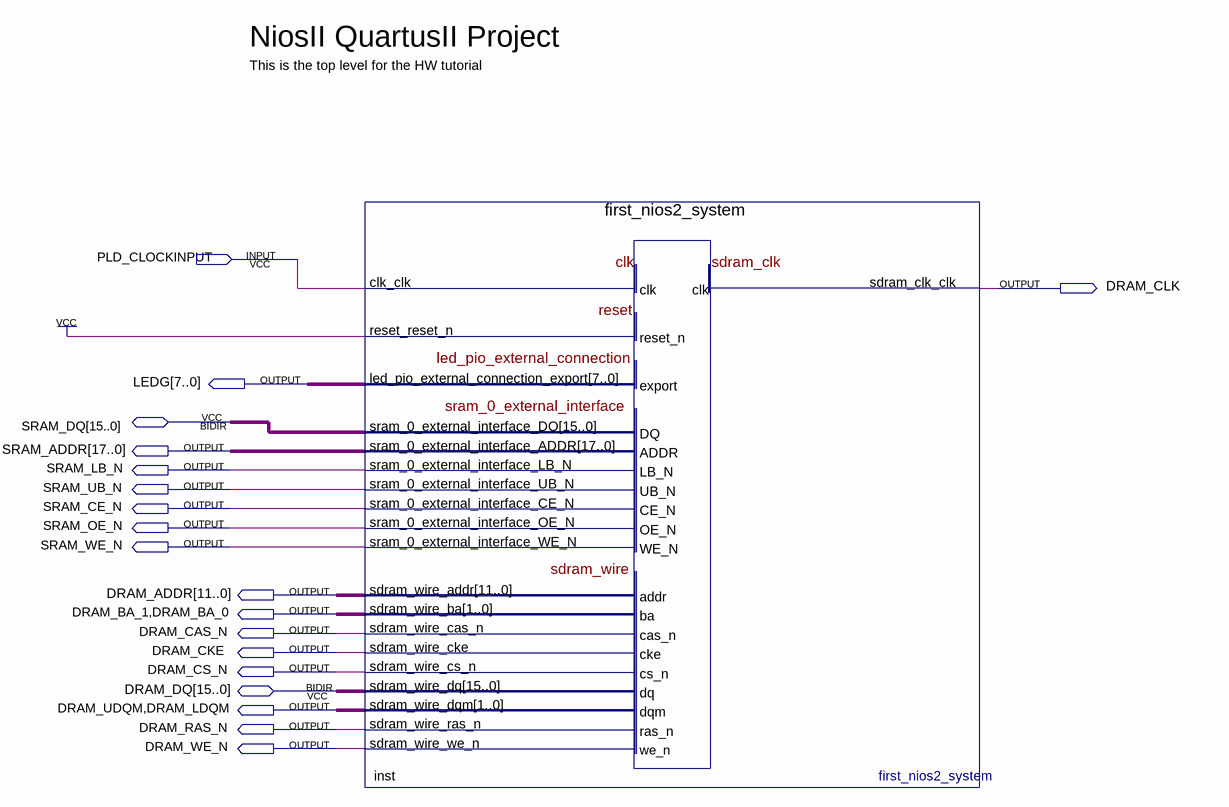
[diagram p0: schematic sheet]
// Quartus schematic nios2_quartus2_project.bdf as structural Verilog: 1 symbols, 19 pins
module nios2_quartus2_project (
  input  PLD_CLOCKINPUT,
  inout  [15:0] SRAM_DQ,
  inout  [15:0] DRAM_DQ,
  output DRAM_CLK,
  output [7:0] LEDG,
  output [17:0] SRAM_ADDR,
  output SRAM_LB_N,
  output SRAM_UB_N,
  output SRAM_CE_N,
  output SRAM_OE_N,
  output SRAM_WE_N,
  output [11:0] DRAM_ADDR,
  output DRAM_BA_1,
  output DRAM_BA_0,
  output DRAM_CAS_N,
  output DRAM_CKE,
  output DRAM_CS_N,
  output DRAM_UDQM,
  output DRAM_LDQM,
  output DRAM_RAS_N,
  output DRAM_WE_N
);

  first_nios2_system inst (
    .clk_clk(PLD_CLOCKINPUT), .reset_reset_n(1'b1), .led_pio_external_connection_export(LEDG),
    .sram_0_external_interface_ADDR(SRAM_ADDR), .sram_0_external_interface_LB_N(SRAM_LB_N),
    .sram_0_external_interface_UB_N(SRAM_UB_N), .sram_0_external_interface_CE_N(SRAM_CE_N),
    .sram_0_external_interface_OE_N(SRAM_OE_N), .sram_0_external_interface_WE_N(SRAM_WE_N),
    .sdram_wire_addr(DRAM_ADDR), .sdram_wire_ba({DRAM_BA_1, DRAM_BA_0}), .sdram_wire_cas_n(DRAM_CAS_N),
    .sdram_wire_cke(DRAM_CKE), .sdram_wire_cs_n(DRAM_CS_N), .sdram_wire_dqm({DRAM_UDQM, DRAM_LDQM}),
    .sdram_wire_ras_n(DRAM_RAS_N), .sdram_wire_we_n(DRAM_WE_N), .sdram_clk_clk(DRAM_CLK),
    .sram_0_external_interface_DQ(SRAM_DQ), .sdram_wire_dq(DRAM_DQ));

  // Notes on the sheet:
  //   NiosII QuartusII Project
  //   This is the top level for the HW tutorial
endmodule
